# Altium project gasp_semg_bandpass_2nd_order.PrjPcb
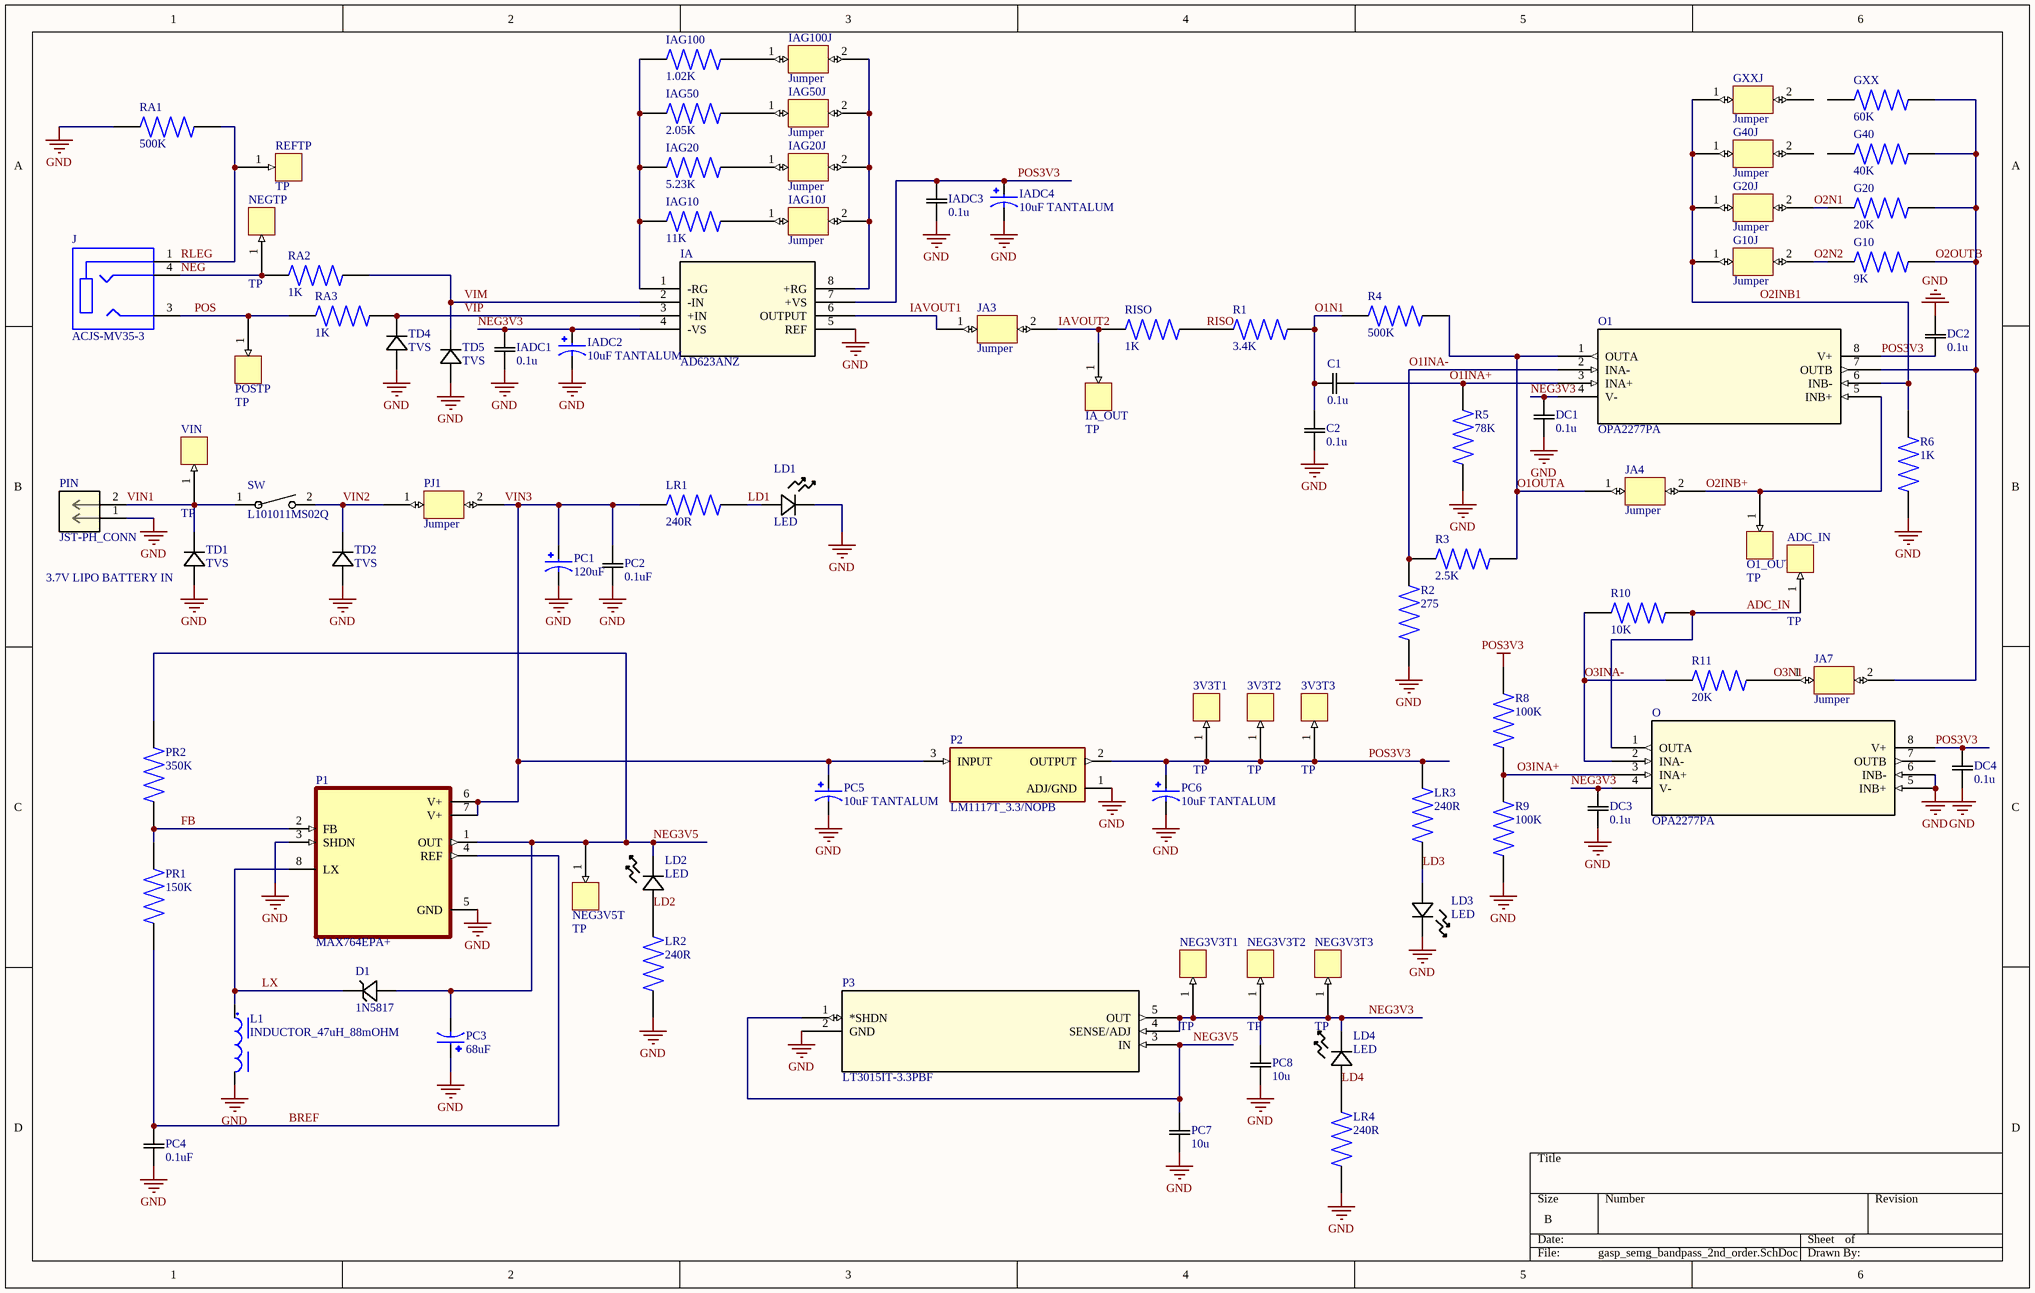
[diagram p0: gasp_semg_bandpass_2nd_order.SchDoc]
1 sheet, 91 parts. Net scope: global (net labels, ports and power ports of the same name join across sheets).
Board file: gasp_semg_bandpass_2nd_order_pcb.PcbDoc

## Sheet gasp_semg_bandpass_2nd_order.SchDoc
size B; SheetNumber: 1; SheetTotal: 1

### Parts
3V3T1  TP  [Test Point2]
3V3T2  TP  [Test Point2]
3V3T3  TP  [Test Point2]
ADC_IN  TP  [Test Point2]
C1  0.1u  [Axial]
C2  0.1u  [Axial]
D1  1N5817  [DO-41_STM]
DC1  0.1u  [Axial]
DC2  0.1u  [Axial]
DC3  0.1u  [Axial]
DC4  0.1u  [Axial]
G10  9K  [Axial]
G10J  Jumper  [2-Pin Jumper]
G20  20K  [Axial]
G20J  Jumper  [2-Pin Jumper]
G40  40K  [Axial]
G40J  Jumper  [2-Pin Jumper]
GXX  60K  [Axial]
GXXJ  Jumper  [2-Pin Jumper]
IA  AD623ANZ  [8-PDIP]
IA_OUT  TP  [Test Point2]
IADC1  0.1u  [Axial]
IADC2  10uF TANTALUM  [CAP RADIAL]
IADC3  0.1u  [Axial]
IADC4  10uF TANTALUM  [CAP RADIAL]
IAG10  11K  [Axial]
IAG10J  Jumper  [2-Pin Jumper]
IAG20  5.23K  [Axial]
IAG20J  Jumper  [2-Pin Jumper]
IAG50  2.05K  [Axial]
IAG50J  Jumper  [2-Pin Jumper]
IAG100  1.02K  [Axial]
IAG100J  Jumper  [2-Pin Jumper]
J  ACJS-MV35-3  [AUDIO JACK II]
JA3  Jumper  [2-Pin Jumper]
JA4  Jumper  [2-Pin Jumper]
JA7  Jumper  [2-Pin Jumper]
L1  INDUCTOR_47uH_88mOHM  [INDUCTOR_47uH_88mOHM]
LD1  LED  [LED_5MM_RADIAL]
LD2  LED  [LED_5MM_RADIAL]
LD3  LED  [LED_5MM_RADIAL]
LD4  LED  [LED_5MM_RADIAL]
LR1  240R  [Axial]
LR2  240R  [Axial]
LR3  240R  [Axial]
LR4  240R  [Axial]
NEG3V3T1  TP  [Test Point2]
NEG3V3T2  TP  [Test Point2]
NEG3V3T3  TP  [Test Point2]
NEG3V5T  TP  [Test Point2]
NEGTP  TP  [Test Point2]
O  OPA2277PA  [8-PDIP]
O1  OPA2277PA  [8-PDIP]
O1_OUT  TP  [Test Point2]
P1  MAX764EPA+  [8-PDIP]
P2  LM1117T_3.3/NOPB  [TO-220-3]
P3  LT3015IT-3.3PBF  [TO220-5_T_LIT]
PC1  120uF  [CAP RADIAL]
PC2  0.1uF  [Axial]
PC3  68uF  [CAP RADIAL]
PC4  0.1uF  [Axial]
PC5  10uF TANTALUM  [CAP RADIAL]
PC6  10uF TANTALUM  [CAP RADIAL]
PC7  10u  [Axial]
PC8  10u  [Axial]
PIN  JST-PH_CONN  [CONN2_B2B-PH-K-S_JST]
PJ1  Jumper  [2-Pin Jumper]
POSTP  TP  [Test Point2]
PR1  150K  [Axial]
PR2  350K  [Axial]
R1  3.4K  [Axial]
R2  275  [Axial]
R3  2.5K  [Axial]
R4  500K  [Axial]
R5  78K  [Axial]
R6  1K  [Axial]
R8  100K  [Axial]
R9  100K  [Axial]
R10  10K  [Axial]
R11  20K  [Axial]
RA1  500K  [Axial]
RA2  1K  [Axial]
RA3  1K  [Axial]
REFTP  TP  [Test Point2]
RISO  1K  [Axial]
SW  L101011MS02Q  [SW_1MS02Q_CNK]
TD1  TVS  [TVS_DIODE_5VWM]
TD2  TVS  [TVS_DIODE_5VWM]
TD4  TVS  [TVS_DIODE_5VWM]
TD5  TVS  [TVS_DIODE_5VWM]
VIN  TP  [Test Point2]

### Nets
GND: C2.2 DC1.2 DC2.2 DC3.2 DC4.2 IA.5(REF) IADC1.2 IADC2.N IADC3.2 IADC4.N L1.2 LD1.1 LD3.1 LR2.1 LR4.1 O.5(INB+) O.6(INB-) P1.3(SHDN) P1.5(GND) P2.1(ADJ/GND) P3.2(GND) PC1.N PC2.2 PC3.P PC4.2 PC5.N PC6.N PC7.2 PC8.2 PIN.1 R2.2 R5.2 R6.2 R9.2 RA1.2 TD1.2 TD2.2 TD4.2 TD5.2
POS3V3: 3V3T1.1 3V3T2.1 3V3T3.1 DC2.1 DC4.1 IA.7(+VS) IADC3.1 IADC4.P LR3.2 O.8(V+) O1.8(V+) P2.2(OUTPUT) PC6.P R8.1
ADC_IN: ADC_IN.1 O.1(OUTA) R10.2
BREF: P1.4(REF) PC4.1 PR1.1
FB: P1.2(FB) PR1.2 PR2.1
IAVOUT1: IA.6(OUTPUT) JA3.1
IAVOUT2: IA_OUT.1 JA3.2 RISO.1
LD1: LD1.2 LR1.1
LD2: LD2.2 LR2.2
LD3: LD3.2 LR3.1
LD4: LD4.2 LR4.2
LX: D1.1 L1.1 P1.8(LX)
NEG: J.4 NEGTP.1 RA2.2
NEG3V3: DC1.1 DC3.1 IA.4(-VS) IADC1.1 IADC2.P LD4.1 NEG3V3T1.1 NEG3V3T2.1 NEG3V3T3.1 O.4(V-) O1.4(V-) P3.4(SENSE/ADJ) P3.5(OUT) PC8.1
NEG3V5: D1.2 LD2.1 NEG3V5T.1 P1.1(OUT) P3.1(*SHDN) P3.3(IN) PC3.N PC7.1 PR2.2
O1INA+: C1.2 O1.3(INA+) R5.1
O1INA-: O1.2(INA-) R2.1 R3.2
O1N1: C1.1 C2.1 R1.1 R4.1
O1OUTA: JA4.1 O1.1(OUTA) R3.1 R4.2
O2INB1: G10J.1 G20J.1 G40J.1 GXXJ.1 O1.6(INB-) R6.1
O2INB+: JA4.2 O1.5(INB+) O1_OUT.1
O2N1: G20.1 G20J.2
O2N2: G10.1 G10J.2
O2OUTB: G10.2 G20.2 G40.2 GXX.2 JA7.2 O1.7(OUTB)
O3INA+: O.3(INA+) R8.2 R9.1
O3INA-: O.2(INA-) R10.1 R11.1
O3N1: JA7.1 R11.2
POS: J.3 POSTP.1 RA3.2
RISO: R1.2 RISO.2
RLEG: J.1 RA1.1 REFTP.1
VIM: IA.2(-IN) RA2.1 TD5.1
VIN1: PIN.2 SW.1 TD1.1 VIN.1
VIN2: PJ1.1 SW.2 TD2.1
VIN3: LR1.2 P1.6(V+) P1.7(V+) P2.3(INPUT) PC1.P PC2.1 PC5.P PJ1.2
VIP: IA.3(+IN) RA3.1 TD4.1
NetIA_1: IA.1(-RG) IAG10.1 IAG20.1 IAG50.1 IAG100.1
NetIA_8: IA.8(+RG) IAG10J.2 IAG20J.2 IAG50J.2 IAG100J.2
NetIAG10_2: IAG10.2 IAG10J.1
NetIAG20_2: IAG20.2 IAG20J.1
NetIAG50_2: IAG50.2 IAG50J.1
NetIAG100_2: IAG100.2 IAG100J.1

Not connected (* = marked no-connect by the designer): G40 1; G40J 2; GXX 1; GXXJ 2; O 7(OUTB)

### Notes on the sheet
- (near TD1) 3.7V LIPO BATTERY IN

### Library data of the parts
C1 C2 DC1-DC4 IADC1 IADC3 PC2 PC4 PC7 PC8 = Cap: Capacitor axial through-hole.; Manufacturer_Name: Kemet; Manufacturer_Part_Number: C410C821J3G5TA; Copyright: Copyright (C) 2025 Ultra Librarian. All rights reserved.
D1 = 1N5817: 20 V, 1 A axial Power Schottky Rectifier; Manufacturer_Name: STMicroelectronics; Copyright: Copyright (C) 2025 Ultra Librarian. All rights reserved.; Manufacturer_Part_Number: 1N5817; Datasheet: https://www.st.com/resource/en/datasheet/1n5817.pdf; Refdes: Refdes
G10 G20 G40 GXX IAG10 IAG20 IAG50 IAG100 LR1-LR4 PR1 PR2 R1-R6 R8-R11 RA1-RA3 RISO = Resistor: Through-hole resistor axial.; MF: Yageo; MP: MFR-25FBF52-10K; SnapEDA_Link: https://www.snapeda.com/parts/MFR-25FBF52-10K/Yageo/view-part/?ref=snap; Package: RADIAL-2 YAGEO; Value: *; Check_prices: https://www.snapeda.com/parts/MFR-25FBF52-10K/Yageo/view-part/?ref=eda
G10J G20J G40J GXXJ IAG10J IAG20J IAG50J IAG100J JA3 JA4 JA7 PJ1 = Jumper: 0.1" 2 pin jumper
IA = AD623ANZ: Single and Dual-Supply, Rail-to-Rail, Low Cost Instrumentation Amplifier. AD623ANZ.; Manufacturer_Name: Analog Devices Inc; Copyright: Copyright (C) 2025 Ultra Librarian. All rights reserved.; Manufacturer_Part_Number: AD623ANZ; RefDes: RefDes; Type: Type
IADC2 IADC4 PC1 PC3 PC5 PC6 = CAP: CAPACITOR RADIAL.; MF: Panasonic; MP: ECA1HM101; Check_prices: https://www.snapeda.com/parts/ECA1HM101/Panasonic/view-part/4478734/?ref=eda; SnapEDA_Link: https://www.snapeda.com/parts/ECA1HM101/Panasonic/view-part/4478734/?ref=snap; Price: None; Availability: No availability data; Package: RADIAL-2 Panasonic; Value: *
J = ACJS-MV35-3: 3.50mm (0.141", 1/8", Mini Plug) - Headphone Phone Jack Stereo (3 Conductor, TRS) Connector Solder Eyelet(s); MP: SJ1-3553NG; Package: None; Price: None; Value: *; Availability: Unavailable
L1 = INDUCTOR_47uH_88mOHM: 47 µH Shielded Drum Core, Wirewound Inductor 3 A 88mOhm Max Radial, Vertical Cylinder. WURTH ELEKTRONIK 7447471470; MF: {'manufacturer': u'Wurth Electronics'}; Package: None; Price: None; Value: *; MP: 7447471470; Availability: Unavailable
LD1-LD4 = LED: LED_5MM_RADIAL; Manufacturer_Name: Cree LED; Manufacturer_Part_Number: C503B-BCN-CV0Z0461; Copyright: Copyright (C) 2025 Ultra Librarian. All rights reserved.
O O1 = OPA2277PA: 10ÂµV, 0.1ÂµV/ËšC, High-Precision, Low-Power Operational Amplifier 8-PDIP; Manufacturer_Name: Texas Instruments; Copyright: Copyright (C) 2025 Ultra Librarian. All rights reserved.; Manufacturer_Part_Number: OPA2277PA; Datasheet: https://www.ti.com/lit/gpn/opa2277; RefDes: RefDes; Type: Type
P1 = MAX764EPA+: IC REG BCK BST ADJ/-5V 8DIP; MF: Maxim Integrated; Purchase-URL: https://pricing.snapeda.com/search/part/MAX764EPA+/?ref=eda; SnapEDA_Link: https://www.snapeda.com/parts/MAX764EPA+/Maxim%20Integrated/view-part/1195027/?ref=snap; Price: None; MP: MAX764EPA+; Package: PDIP-8 Maxim; Value: *; Availability: Warning
P2 = LM1117T_3.3/NOPB: 3.3V Linear Voltage Regulator IC Positive Fixed 1 Output 800mA TO-220-3.; MF: Texas Instruments; MP: LM1117T-3.3/NOPB; SnapEDA_Link: https://www.snapeda.com/parts/LM1117T-3.3/NOPB/Texas+Instruments/view-part/?ref=snap; Package: TO-220-3 Texas Instruments; Value: *; Check_prices: https://www.snapeda.com/parts/LM1117T-3.3/NOPB/Texas+Instruments/view-part/?ref=eda
P3 = LT3015IT-3.3PBF: Linear Voltage Regulator IC Negative Fixed 1 Output 1.5A TO-220-5No Description Available; Manufacturer_Name: Analog Devices Inc; Manufacturer_Part_Number: LT3015IT-3.3#PBF; Copyright: Copyright (C) 2025 Ultra Librarian. All rights reserved.; RefDes: RefDes; Type: Type
PIN = JST-PH_CONN: CONN HEADER VERT 2POS 2MM; Mfr_Name: JST; RefDes: RefDes; Type: Type
SW = L101011MS02Q: Slide Switch SPST Through Hole.; Mfr_Name: C&K Components
TD1 TD2 TD4 TD5 = TVS: 9.2V Clamp 55.4A Ipp Tvs Diode Through Hole DO-204AC (DO-15).; Manufacturer_Name: Littelfuse Inc; Manufacturer_Part_Number: SA5.0CA; Copyright: Copyright (C) 2025 Ultra Librarian. All rights reserved.